# Altium schematic sheet rs232-4ch.SchDoc
size A4
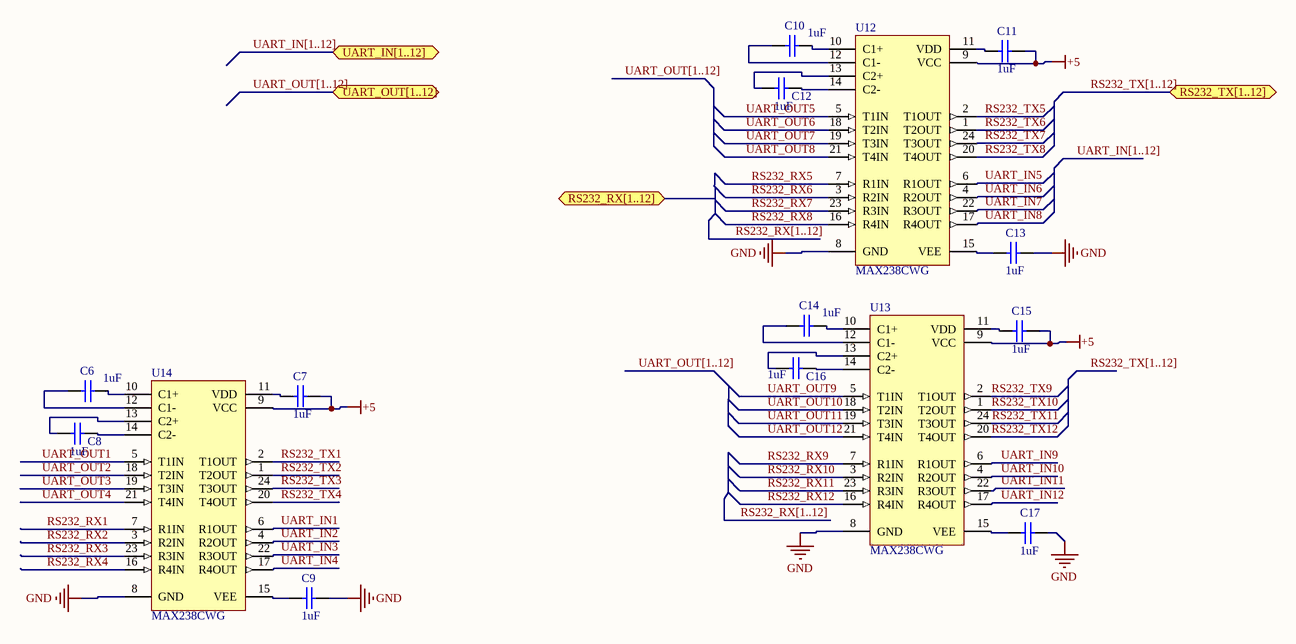
[diagram p0: rs232-4ch.SchDoc]

## Parts
C6  value 1uF  [CAPC1608M]  (hidden comment: Cap)
C7  value 1uF  [CAPC1608M]  (hidden comment: Cap)
C8  value 1uF  [CAPC1608M]  (hidden comment: Cap)
C9  value 1uF  [CAPC1608M]  (hidden comment: Cap)
C10  value 1uF  [CAPC1608M]  (hidden comment: Cap)
C11  value 1uF  [CAPC1608M]  (hidden comment: Cap)
C12  value 1uF  [CAPC1608M]  (hidden comment: Cap)
C13  value 1uF  [CAPC1608M]  (hidden comment: Cap)
C14  value 1uF  [CAPC1608M]  (hidden comment: Cap)
C15  value 1uF  [CAPC1608M]  (hidden comment: Cap)
C16  value 1uF  [CAPC1608M]  (hidden comment: Cap)
C17  value 1uF  [CAPC1608M]  (hidden comment: Cap)
U12  MAX238CWG  [WSO24_N]
U13  MAX238CWG  [WSO24_N]
U14  MAX238CWG  [WSO24_N]

## Ports
RS232_RX[1..12], RS232_TX[1..12], UART_IN[1..12], UART_OUT[1..12]

## Nets
+5: C7.1 C11.1 C15.1 U12.9(VCC) U13.9(VCC) U14.9(VCC)
GND: C9.1 C13.1 C17.1 U12.8(GND) U13.8(GND) U14.8(GND)
RS232_RX1: U14.7(R1IN)
RS232_RX2: U14.3(R2IN)
RS232_RX3: U14.23(R3IN)
RS232_RX4: U14.16(R4IN)
RS232_RX5: U12.7(R1IN)
RS232_RX6: U12.3(R2IN)
RS232_RX7: U12.23(R3IN)
RS232_RX8: U12.16(R4IN)
RS232_RX9: U13.7(R1IN)
RS232_RX10: U13.3(R2IN)
RS232_RX11: U13.23(R3IN)
RS232_RX12: U13.16(R4IN)
RS232_TX1: U14.2(T1OUT)
RS232_TX2: U14.1(T2OUT)
RS232_TX3: U14.24(T3OUT)
RS232_TX4: U14.20(T4OUT)
RS232_TX5: U12.2(T1OUT)
RS232_TX6: U12.1(T2OUT)
RS232_TX7: U12.24(T3OUT)
RS232_TX8: U12.20(T4OUT)
RS232_TX9: U13.2(T1OUT)
RS232_TX10: U13.1(T2OUT)
RS232_TX11: U13.24(T3OUT)
RS232_TX12: U13.20(T4OUT)
UART_IN1: U14.6(R1OUT)
UART_IN2: U14.4(R2OUT)
UART_IN3: U14.22(R3OUT)
UART_IN4: U14.17(R4OUT)
UART_IN5: U12.6(R1OUT)
UART_IN6: U12.4(R2OUT)
UART_IN7: U12.22(R3OUT)
UART_IN8: U12.17(R4OUT)
UART_IN9: U13.6(R1OUT)
UART_IN10: U13.4(R2OUT)
UART_IN11: U13.22(R3OUT)
UART_IN12: U13.17(R4OUT)
UART_OUT1: U14.5(T1IN)
UART_OUT2: U14.18(T2IN)
UART_OUT3: U14.19(T3IN)
UART_OUT4: U14.21(T4IN)
UART_OUT5: U12.5(T1IN)
UART_OUT6: U12.18(T2IN)
UART_OUT7: U12.19(T3IN)
UART_OUT8: U12.21(T4IN)
UART_OUT9: U13.5(T1IN)
UART_OUT10: U13.18(T2IN)
UART_OUT11: U13.19(T3IN)
UART_OUT12: U13.21(T4IN)
NetC6_1: C6.1 U14.10(C1+)
NetC6_2: C6.2 U14.12(C1-)
NetC7_2: C7.2 U14.11(VDD)
NetC8_1: C8.1 U14.14(C2-)
NetC8_2: C8.2 U14.13(C2+)
NetC9_2: C9.2 U14.15(VEE)
NetC10_1: C10.1 U12.10(C1+)
NetC10_2: C10.2 U12.12(C1-)
NetC11_2: C11.2 U12.11(VDD)
NetC12_1: C12.1 U12.14(C2-)
NetC12_2: C12.2 U12.13(C2+)
NetC13_2: C13.2 U12.15(VEE)
NetC14_1: C14.1 U13.10(C1+)
NetC14_2: C14.2 U13.12(C1-)
NetC15_2: C15.2 U13.11(VDD)
NetC16_1: C16.1 U13.14(C2-)
NetC16_2: C16.2 U13.13(C2+)
NetC17_2: C17.2 U13.15(VEE)

## Buses and harness runs
bus RS232_RX[1..12]
bus RS232_RX[1..12] = port RS232_RX[1..12]
bus RS232_TX[1..12]
bus RS232_TX[1..12] = port RS232_TX[1..12]
bus UART_IN[1..12]
bus UART_IN[1..12] = port UART_IN[1..12]
bus UART_OUT[1..12]
bus UART_OUT[1..12] = port UART_OUT[1..12]

## Library data of the parts
C6-C17 = Cap: Capacitor; Published: 8-Jun-2000; LatestRevisionDate: 17-Jul-2002; LatestRevisionNote: Re-released for DXP Platform.; PackageReference: RAD-0.3; Publisher: Altium Limited; PackageDescription: Radial Cap, Thru-Hole; 2 Leads; 0.3 in Pin Spacing
U12-U14 = MAX238CWG: +5V Powered RS-232 Driver/Receiver; Published: 16-Jan-2001; LatestRevisionDate: 13-Apr-2006; LatestRevisionNote: IPC-7351 Footprint Added.; DatasheetVersion: Apr-1992; PackageReference: WSO24; Publisher: Altium Limited; PackageDescription: 24-Pin Small Outline Integrated Circuit 1.27 mm Pitch; ComponentLink1Description: Manufacturer Link; ComponentLink1URL: http://www.maxim-ic.com/; ComponentLink2Description: Datasheet; ComponentLink2URL: http://pdfserv.maxim-ic.com/en/ds/MAX220-MAX249.pdf